# EAGLE schematic Currnet Shunt (EAGLE 7.5.0)
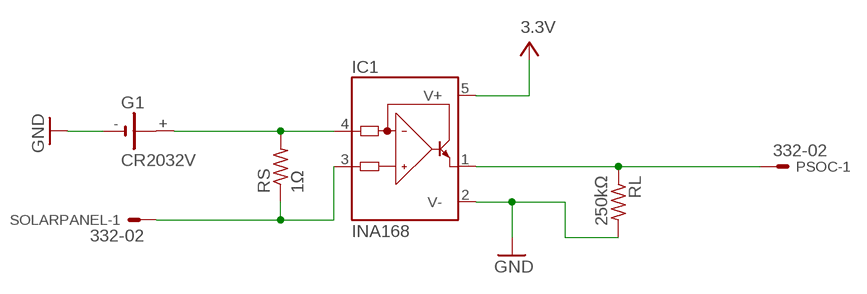
[diagram p0: schematic, sheet 1]

## Parts
G1  CR2032V  [CR2032V]
IC1  INA168  [SOT23-5]
PSOC  332-02  [332-02]
RL  250kΩ  R-US_0204/2V  [0204V]
RS  1Ω  R-US_0204/2V  [0204V]
SOLARPANEL  332-02  [332-02]

## Nets
GND: G1.- IC1.2(V-) RL.2
N$1: IC1.3(IN+) RS.1 SOLARPANEL.1
N$2: G1.+ IC1.4(IN-) RS.2
N$3: IC1.1(OUT) PSOC.1 RL.1
V+: IC1.5(V+) ; supply symbol labelled 3.3V
Unconnected: G1.+@1(+) PSOC.2 SOLARPANEL.2

## Library data of the parts
G1 = battery:CR2032V: LI BATTERY Varta
IC1 = burr-brown:INA168: High-Side Measurement Current Shunt Monitor; MF: TEXAS INSTRUMENTS; MPN: INA168NA/250; OC_FARNELL: 4375737; OC_NEWARK: 35C1744
PSOC SOLARPANEL = con-garry:332-02: 2 Pin - 2mm Dual Row Source: www.mpe-connector.de / garry_shortform_2012.pdf
RL RS = resistor:R-US_: RESISTOR, American symbol